# EAGLE design Breakout_carrier_bittern (EAGLE 7.6.0)
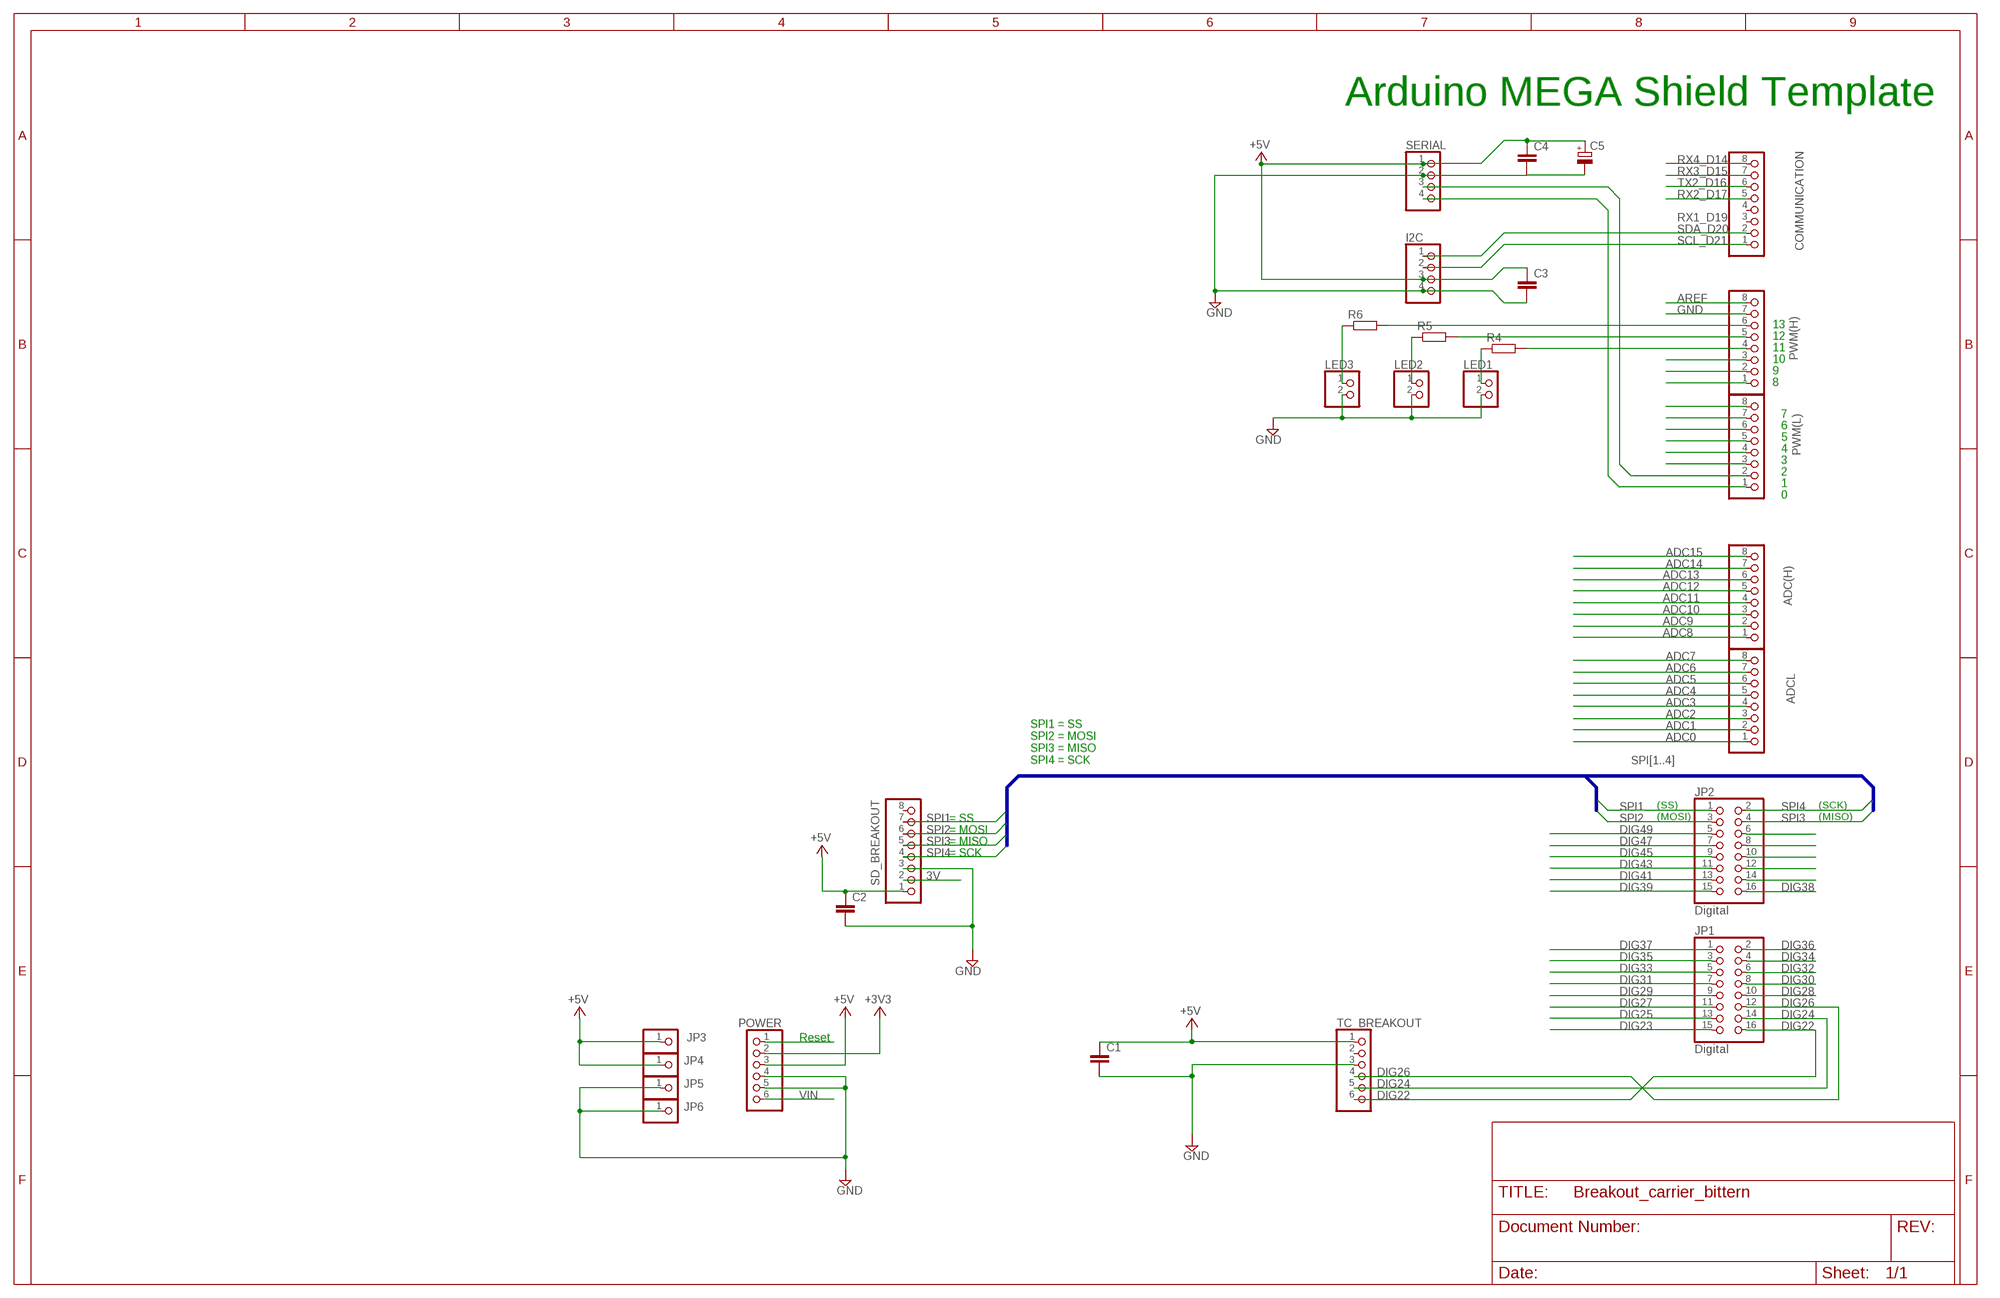
[diagram p0: schematic, sheet 1]

## Parts
ADC(H)  PINHD-1X8  [1X08]
ADCL  PINHD-1X8  [1X08]
C1  C-EU050-045X075  [C050-045X075]
C2  C-EU050-045X075  [C050-045X075]
C3  C-EU050-045X075  [C050-045X075]
C4  C-EU050-045X075  [C050-045X075]
C5  CPOL-EUE2.5-6  [E2,5-6]
COMMUNICATION  PINHD-1X8  [1X08]
I2C  PINHD-1X4  [1X04]
JP1  Digital  PINHD-2X8  [2X08]
JP2  Digital  PINHD-2X8  [2X08]
JP3  PINHD-1X1  [1X01]
JP4  PINHD-1X1  [1X01]
JP5  PINHD-1X1  [1X01]
JP6  PINHD-1X1  [1X01]
LED1  PINHD-1X2  [1X02]
LED2  PINHD-1X2  [1X02]
LED3  PINHD-1X2  [1X02]
POWER  PINHD-1X6  [1X06]
PWM(H)  PINHD-1X8  [1X08]
PWM(L)  PINHD-1X8  [1X08]
R4  R-EU_0309/12  [0309/12]
R5  R-EU_0309/12  [0309/12]
R6  R-EU_0309/12  [0309/12]
SD_BREAKOUT  PINHD-1X8  [1X08]
SERIAL  PINHD-1X4  [1X04]
TC_BREAKOUT  PINHD-1X6  [1X06]

## Nets
3V [gnd]: SD_BREAKOUT.2
+3V3 [power]: POWER.2
+5V [usbvcc]: C1.1 C2.1 C3.1 C4.1 C5.+ I2C.3 JP3.1 JP4.1 POWER.3 SD_BREAKOUT.1 SERIAL.1 TC_BREAKOUT.1
ADC0: ADCL.1
ADC1: ADCL.2
ADC2: ADCL.3
ADC3: ADCL.4
ADC4: ADCL.5
ADC5: ADCL.6
ADC6: ADCL.7
ADC7: ADCL.8
ADC8: ADC(H).1
ADC9: ADC(H).2
ADC10: ADC(H).3
ADC11: ADC(H).4
ADC12: ADC(H).5
ADC13: ADC(H).6
ADC14: ADC(H).7
ADC15: ADC(H).8
AREF: PWM(H).8
DIG22: JP1.16 TC_BREAKOUT.6
DIG23: JP1.15
DIG24: JP1.14 TC_BREAKOUT.5
DIG25: JP1.13
DIG26: JP1.12 TC_BREAKOUT.4
DIG27: JP1.11
DIG28: JP1.10
DIG29: JP1.9
DIG30: JP1.8
DIG31: JP1.7
DIG32: JP1.6
DIG33: JP1.5
DIG34: JP1.4
DIG35: JP1.3
DIG36: JP1.2
DIG37: JP1.1
DIG38: JP2.16
DIG39: JP2.15
DIG41: JP2.13
DIG43: JP2.11
DIG45: JP2.9
DIG47: JP2.7
DIG49: JP2.5
GND [gnd]: C1.2 C2.2 C3.2 C4.2 C5.- I2C.4 JP5.1 JP6.1 LED1.2 LED2.2 LED3.2 POWER.4 POWER.5 PWM(H).7 SD_BREAKOUT.3 SERIAL.2 TC_BREAKOUT.3
N$1: PWM(L).2 SERIAL.3
N$3: PWM(L).3
N$4: PWM(L).4
N$5: PWM(L).5
N$6: PWM(L).6
N$7: PWM(L).7
N$8: PWM(L).8
N$9: PWM(H).1
N$10: PWM(H).2
N$11: PWM(H).3
N$12: PWM(H).4 R4.2
N$13: PWM(H).5 R5.2
N$14: PWM(H).6 R6.2
N$15: LED3.1 R6.1
N$16: LED2.1 R5.1
N$17: LED1.1 R4.1
N$24: JP2.14
N$25: JP2.12
N$26: JP2.10
N$27: JP2.8
N$28: JP2.6
RESET: POWER.1
RX1_D19: PWM(L).1 SERIAL.4
RX2_D17: COMMUNICATION.5
RX3_D15: COMMUNICATION.7
RX4_D14: COMMUNICATION.8
SCL_D21: COMMUNICATION.1 I2C.2
SDA_D20: COMMUNICATION.2 I2C.1
SPI1: JP2.1 SD_BREAKOUT.7
SPI2: JP2.3 SD_BREAKOUT.6
SPI3: JP2.4 SD_BREAKOUT.5
SPI4: JP2.2 SD_BREAKOUT.4
TX2_D16: COMMUNICATION.6
VIN [power]: POWER.6
Unconnected: COMMUNICATION.3 COMMUNICATION.4 SD_BREAKOUT.8 TC_BREAKOUT.2

## Buses
SPI[1..4]

## Notes on the sheet
- Arduino MEGA Shield Template
- 13
- 12
- 11
- 10
- 9
- 8
- 7
- 6
- 5
- 4
- 3
- 2
- 1
- 0
- SPI1 = SS
  SPI2 = MOSI
  SPI3 = MISO
  SPI4 = SCK
- (SS) | (SCK)
- (MOSI) | (MISO)
- = SS
- = MOSI
- = MISO
- = SCK
- Reset

## Library data of the parts
ADC(H) ADCL COMMUNICATION PWM(H) PWM(L) SD_BREAKOUT = pinhead:PINHD-1X8: PIN HEADER
C1-C4 = rcl:C-EU: CAPACITOR, European symbol
C5 = rcl:CPOL-EU: POLARIZED CAPACITOR, European symbol
I2C SERIAL = pinhead:PINHD-1X4: PIN HEADER
JP1 JP2 = pinhead:PINHD-2X8: PIN HEADER
JP3-JP6 = pinhead:PINHD-1X1: PIN HEADER
LED1-LED3 = pinhead:PINHD-1X2: PIN HEADER
POWER TC_BREAKOUT = pinhead:PINHD-1X6: PIN HEADER
R4-R6 = resistor:R-EU_: RESISTOR, European symbol

## Net classes
0 default: width 0.203 mm, drill 0.406 mm, clearance 0.203 mm
1 power: width 0.61 mm, drill 0.711 mm, clearance 0.203 mm
2 gnd: width 0.305 mm, drill 0.711 mm, clearance 0.203 mm
3 usbvcc: width 0.508 mm, drill 0.711 mm, clearance 0.203 mm

## Board
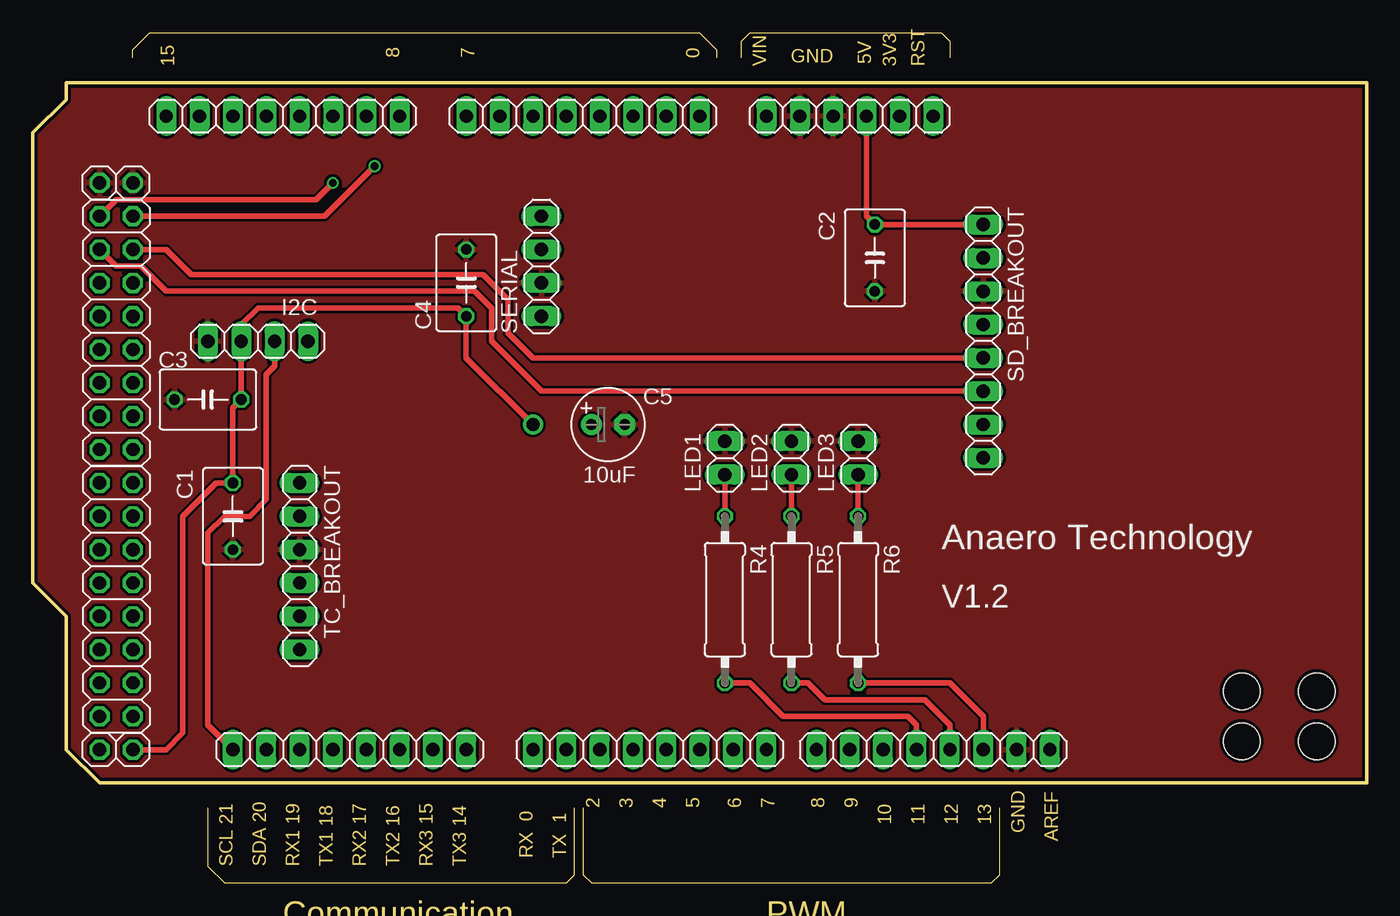
[diagram p1: board, top side]
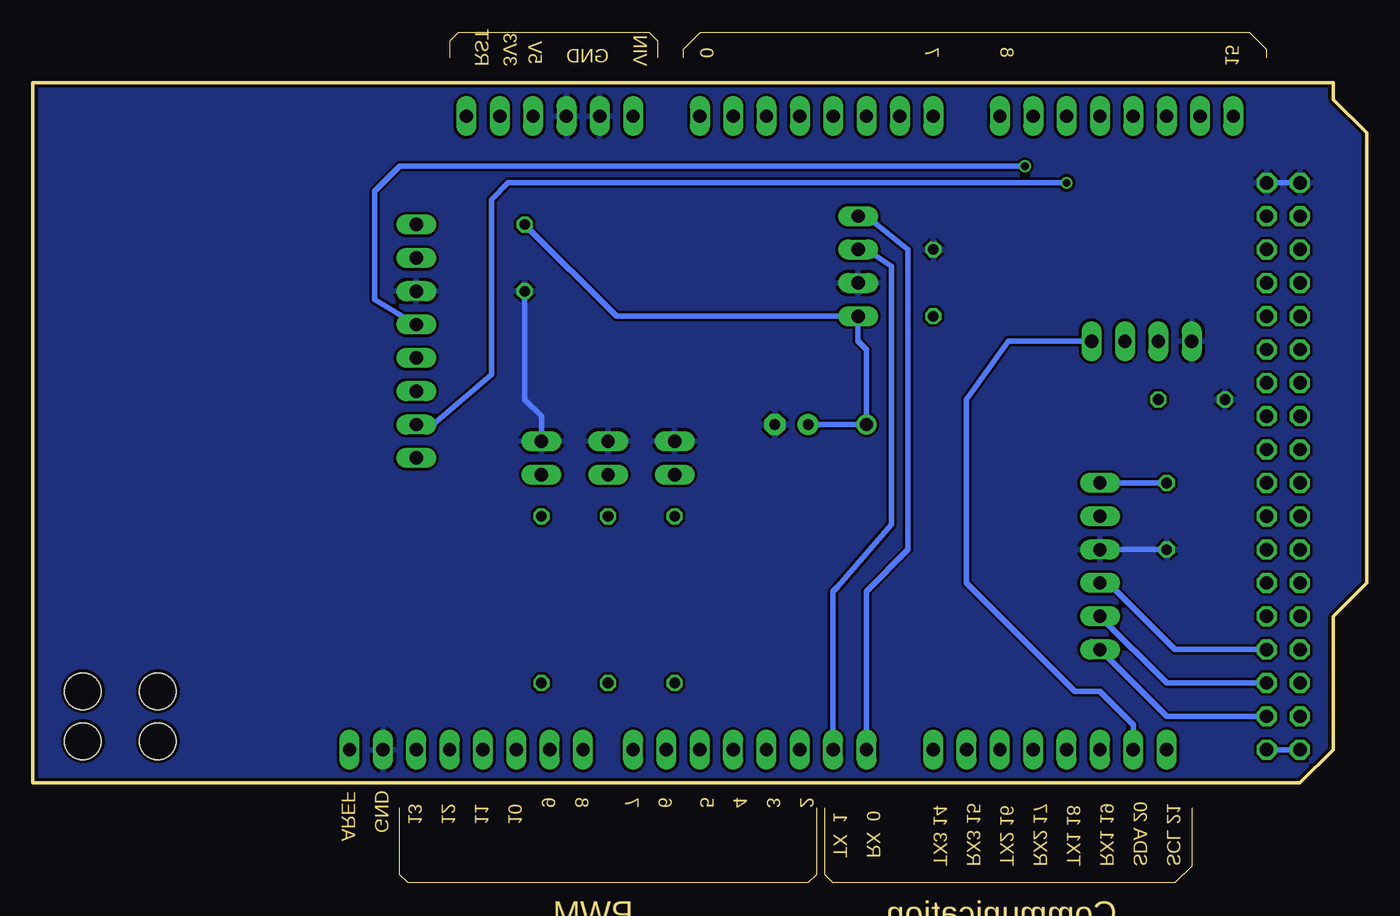
[diagram p2: board, bottom side, seen from below]

Size 101.6 x 64.77 mm. Coordinates in mm from the lower left corner, seen from the top.
Outline: 7.62,62.87 7.62,63.5 8.89,64.77 50.8,64.77 52.07,63.5 52.07,62.87
Outline: 53.97,62.87 53.97,64.13 54.61,64.77 69.22,64.77 69.85,64.13 69.85,62.87
Outline: 13.34,5.71 13.34,1.27 14.61,0 40.64,0 41.27,0.63 41.27,5.71
Outline: 41.91,5.71 41.91,0.63 42.54,0 73.03,0 73.66,0.63 73.66,5.71
Outline: 101.6,7.62 5.08,7.62 2.54,10.16 2.54,20.32 0,22.86 0,57.15 2.54,59.69 2.54,60.96 101.6,60.96 101.6,7.62
Copper layers (1*2*15*16): Top 0.035mm / dielectric 0.2mm / Route2 0.0175mm / dielectric 1.1mm / Route15 0.0175mm / dielectric 0.2mm / Bottom 0.035mm
Design rules "SeeedStudio_DRU_no_angle_20130527": minimum track width 6mil, minimum drill 12mil, track to track 6mil, track to pad 6mil, pad to pad 6mil, via to via 6mil, smd to smd 0mil, copper to edge 10mil, drill to drill 10mil, minimum pad ring 6mil, minimum via ring 6mil, stop-mask expansion 2mil, vias tented up to drill 25mil, thermal gap 10mil
Holes 2.8 mm at 97.79,10.79 97.79,14.61 92.08,14.61 92.08,10.79

### Footprints (pad centres in the part's own frame; a part is rotated, then mirrored left to right if it is on the bottom)
1X08 = drill 1.016 long: 1 -8.89,0; 2 -6.35,0; 3 -3.81,0; 4 -1.27,0; 5 1.27,0; 6 3.81,0; 7 6.35,0; 8 8.89,0
C050-045X075 = drill 0.813 octagon: 1 -2.54,0; 2 2.54,0
E2,5-6 = drill 0.813 pad 1.6: + -1.27,0 | drill 0.813 pad 1.6 octagon: - 1.27,0
1X04 = drill 1.016 long: 1 -3.81,0; 2 -1.27,0; 3 1.27,0; 4 3.81,0
2X08 = drill 1.016 octagon: 1 -8.89,-1.27; 2 -8.89,1.27; 3 -6.35,-1.27; 4 -6.35,1.27; 5 -3.81,-1.27; 6 -3.81,1.27; 7 -1.27,-1.27; 8 -1.27,1.27; 9 1.27,-1.27; 10 1.27,1.27; 11 3.81,-1.27; 12 3.81,1.27; 13 6.35,-1.27; 14 6.35,1.27; 15 8.89,-1.27; 16 8.89,1.27
1X01 = drill 1.016 octagon: 1 0,0
1X02 = drill 1.016 long: 1 -1.27,0; 2 1.27,0
1X06 = drill 1.016 long: 1 -6.35,0; 2 -3.81,0; 3 -1.27,0; 4 1.27,0; 5 3.81,0; 6 6.35,0
0309/12 = drill 0.813 octagon: 1 -6.35,0; 2 6.35,0

### Placement (x,y rotation side)
ADC(H)  19.05,58.42 180 top
ADCL  41.91,58.42 180 top
C1  15.24,27.94 270 top
C2  64.14,47.62 270 top
C3  13.34,36.83 180 top
C4  33.02,45.72 90 top
C5  43.81,34.92 0 top
COMMUNICATION  24.13,10.16 0 top
I2C  17.14,41.27 180 top
JP1  6.35,21.59 270 top
JP2  6.35,41.91 270 top
JP3  7.62,10.16 180 top
JP4  5.08,10.16 180 top
JP5  7.62,53.34 180 top
JP6  5.08,53.34 180 top
LED1  52.7,32.38 90 top
LED2  57.78,32.38 90 top
LED3  62.87,32.38 90 top
POWER  62.23,58.42 180 top
PWM(H)  68.58,10.16 0 top
PWM(L)  46.99,10.16 0 top
R4  52.7,21.59 270 top
R5  57.78,21.59 270 top
R6  62.87,21.59 270 top
SD_BREAKOUT  72.39,41.27 270 top
SERIAL  38.73,46.99 90 top
TC_BREAKOUT  20.32,24.13 270 top

### Tracks (layer width: path | path; a pad name or v marks a point on that pad's centre or on a via)
+5V  (via drill 1)
  Top 0.406: JP3.1 10.16,10.16 11.43,11.43 11.43,27.94 13.97,30.48 C1.1 15.24,36.2 C3.1 I2C.3 15.88,42.55 17.14,43.82 32.38,43.82 C4.1 33.02,40.01 v38.1,34.92 | POWER.3 63.5,50.8 C2.1 SD_BREAKOUT.1
  Bottom 0.406: C1.1 TC_BREAKOUT.1 | JP4.1 JP3.1 | C2.1 57.15,43.18 SERIAL.1 38.73,41.27 38.1,40.64 v38.1,34.92 C5.+
DIG22
  Bottom 0.406: JP1.16 15.24,12.7 TC_BREAKOUT.6 20.96,18.41
DIG24
  Bottom 0.406: JP1.14 15.24,15.24 TC_BREAKOUT.5
DIG26
  Bottom 0.406: JP1.12 14.61,17.78 19.68,22.86 TC_BREAKOUT.4
GND
  Bottom 0.406: JP6.1 JP5.1 | C1.2 TC_BREAKOUT.3 | C2.2 64.14,36.83 62.87,35.56 LED3.2
  pour Bottom: 0,60.96 102.23,60.96 102.23,6.98 -0.64,6.98 -0.64,8.89
  pour Top: -1.27,60.96 -1.27,6.98 103.51,6.98 103.51,60.96
N$1
  Bottom 0.406: SERIAL.3 38.1,48.26 36.2,46.99 36.2,27.3 40.32,22.54 40.64,22.23 PWM(L).2
N$12
  Top 0.406: R4.2 54.61,15.24 57.15,12.7 66.67,12.7 67.31,12.06 PWM(H).4
N$13
  Top 0.406: R5.2 59.05,15.24 60.32,13.97 67.95,13.97 69.85,12.06 PWM(H).5
N$14
  Top 0.406: R6.2 69.85,15.24 72.39,12.7 PWM(H).6
N$15
  Top 0.406: LED3.1 R6.1
N$16
  Top 0.406: LED2.1 R5.1
N$17
  Top 0.406: LED1.1 R4.1
RX1_D19
  Bottom 0.406: SERIAL.4 38.1,50.8 34.92,48.26 34.92,25.4 38.1,22.23 PWM(L).1
SCL_D21
  Top 0.406: COMMUNICATION.1 13.34,12.06 13.34,26.67 14.61,27.94 16.51,27.94 17.78,29.21 17.78,32.38 17.78,33.02 17.78,38.73 18.41,39.37 I2C.2
SDA_D20
  Bottom 0.406: COMMUNICATION.2 17.78,12.06 20.32,14.61 22.23,14.61 30.48,22.86 30.48,36.83 27.3,41.27 I2C.1
SPI1  (via drill 0.6)
  Top 0.406: JP2.1 6.35,52.07 21.59,52.07 v22.86,53.34
  Bottom 0.406: v22.86,53.34 65.41,53.34 66.67,52.07 66.67,38.73 71.12,34.92 SD_BREAKOUT.7
SPI2
  Top 0.406: SD_BREAKOUT.6 38.73,37.46 34.92,41.27 34.92,43.82 33.65,45.09 10.16,45.09 8.26,46.99 6.35,46.99 JP2.3
SPI3
  Top 0.406: SD_BREAKOUT.5 38.1,40.01 36.2,41.91 36.2,44.45 34.29,46.36 12.07,46.36 10.16,48.26 JP2.4
SPI4  (via drill 0.6)
  Top 0.406: JP2.2 22.23,50.8 v26.04,54.61
  Bottom 0.406: v26.04,54.61 73.66,54.61 75.56,52.7 75.56,44.45 SD_BREAKOUT.4

### Text on the board
Dimension: 5V | 3V3 | 8 | 7 | 0 | GND | 15 | VIN | RST | 2 | 3 | 4 | 5 | 6 | 7 | 8 | 9 | 10 | 11 | 12 | 13 | GND | AREF | RX 0 | TX 1 | SCL 21 | SDA 20 | RX1 19 | TX1 18 | RX2 17 | TX2 16 | RX3 15 | TX3 14 | Communication | PWM
tPlace: 10uF | Anaero Technology | V1.2
tOrigins: Analog In | Power